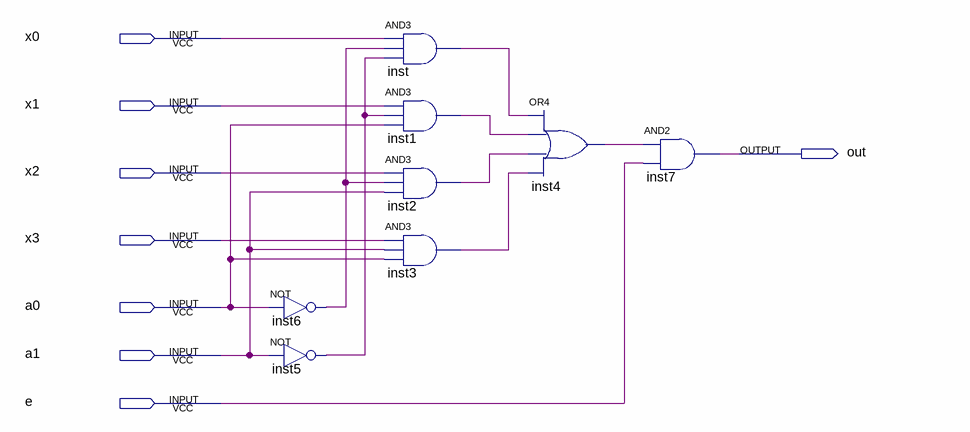
[diagram p0: schematic sheet]
// Quartus schematic mux41.bdf as structural Verilog: 8 symbols, 8 pins
module mux41 (
  input  x0,
  input  x1,
  input  x2,
  input  x3,
  input  a0,
  input  a1,
  input  e,
  output out
);

  wire inst1_out, inst2_out, inst3_out, inst4_out, inst5_out, inst6_out, inst_out;

  not inst6 (inst6_out, a0);
  not inst5 (inst5_out, a1);
  and inst (inst_out, x0, inst6_out, inst5_out);
  and inst1 (inst1_out, x1, inst5_out, a0);
  and inst2 (inst2_out, x2, inst6_out, a1);
  and inst3 (inst3_out, x3, a1, a0);
  or inst4 (inst4_out, inst_out, inst1_out, inst2_out, inst3_out);
  and inst7 (out, inst4_out, e);
endmodule
